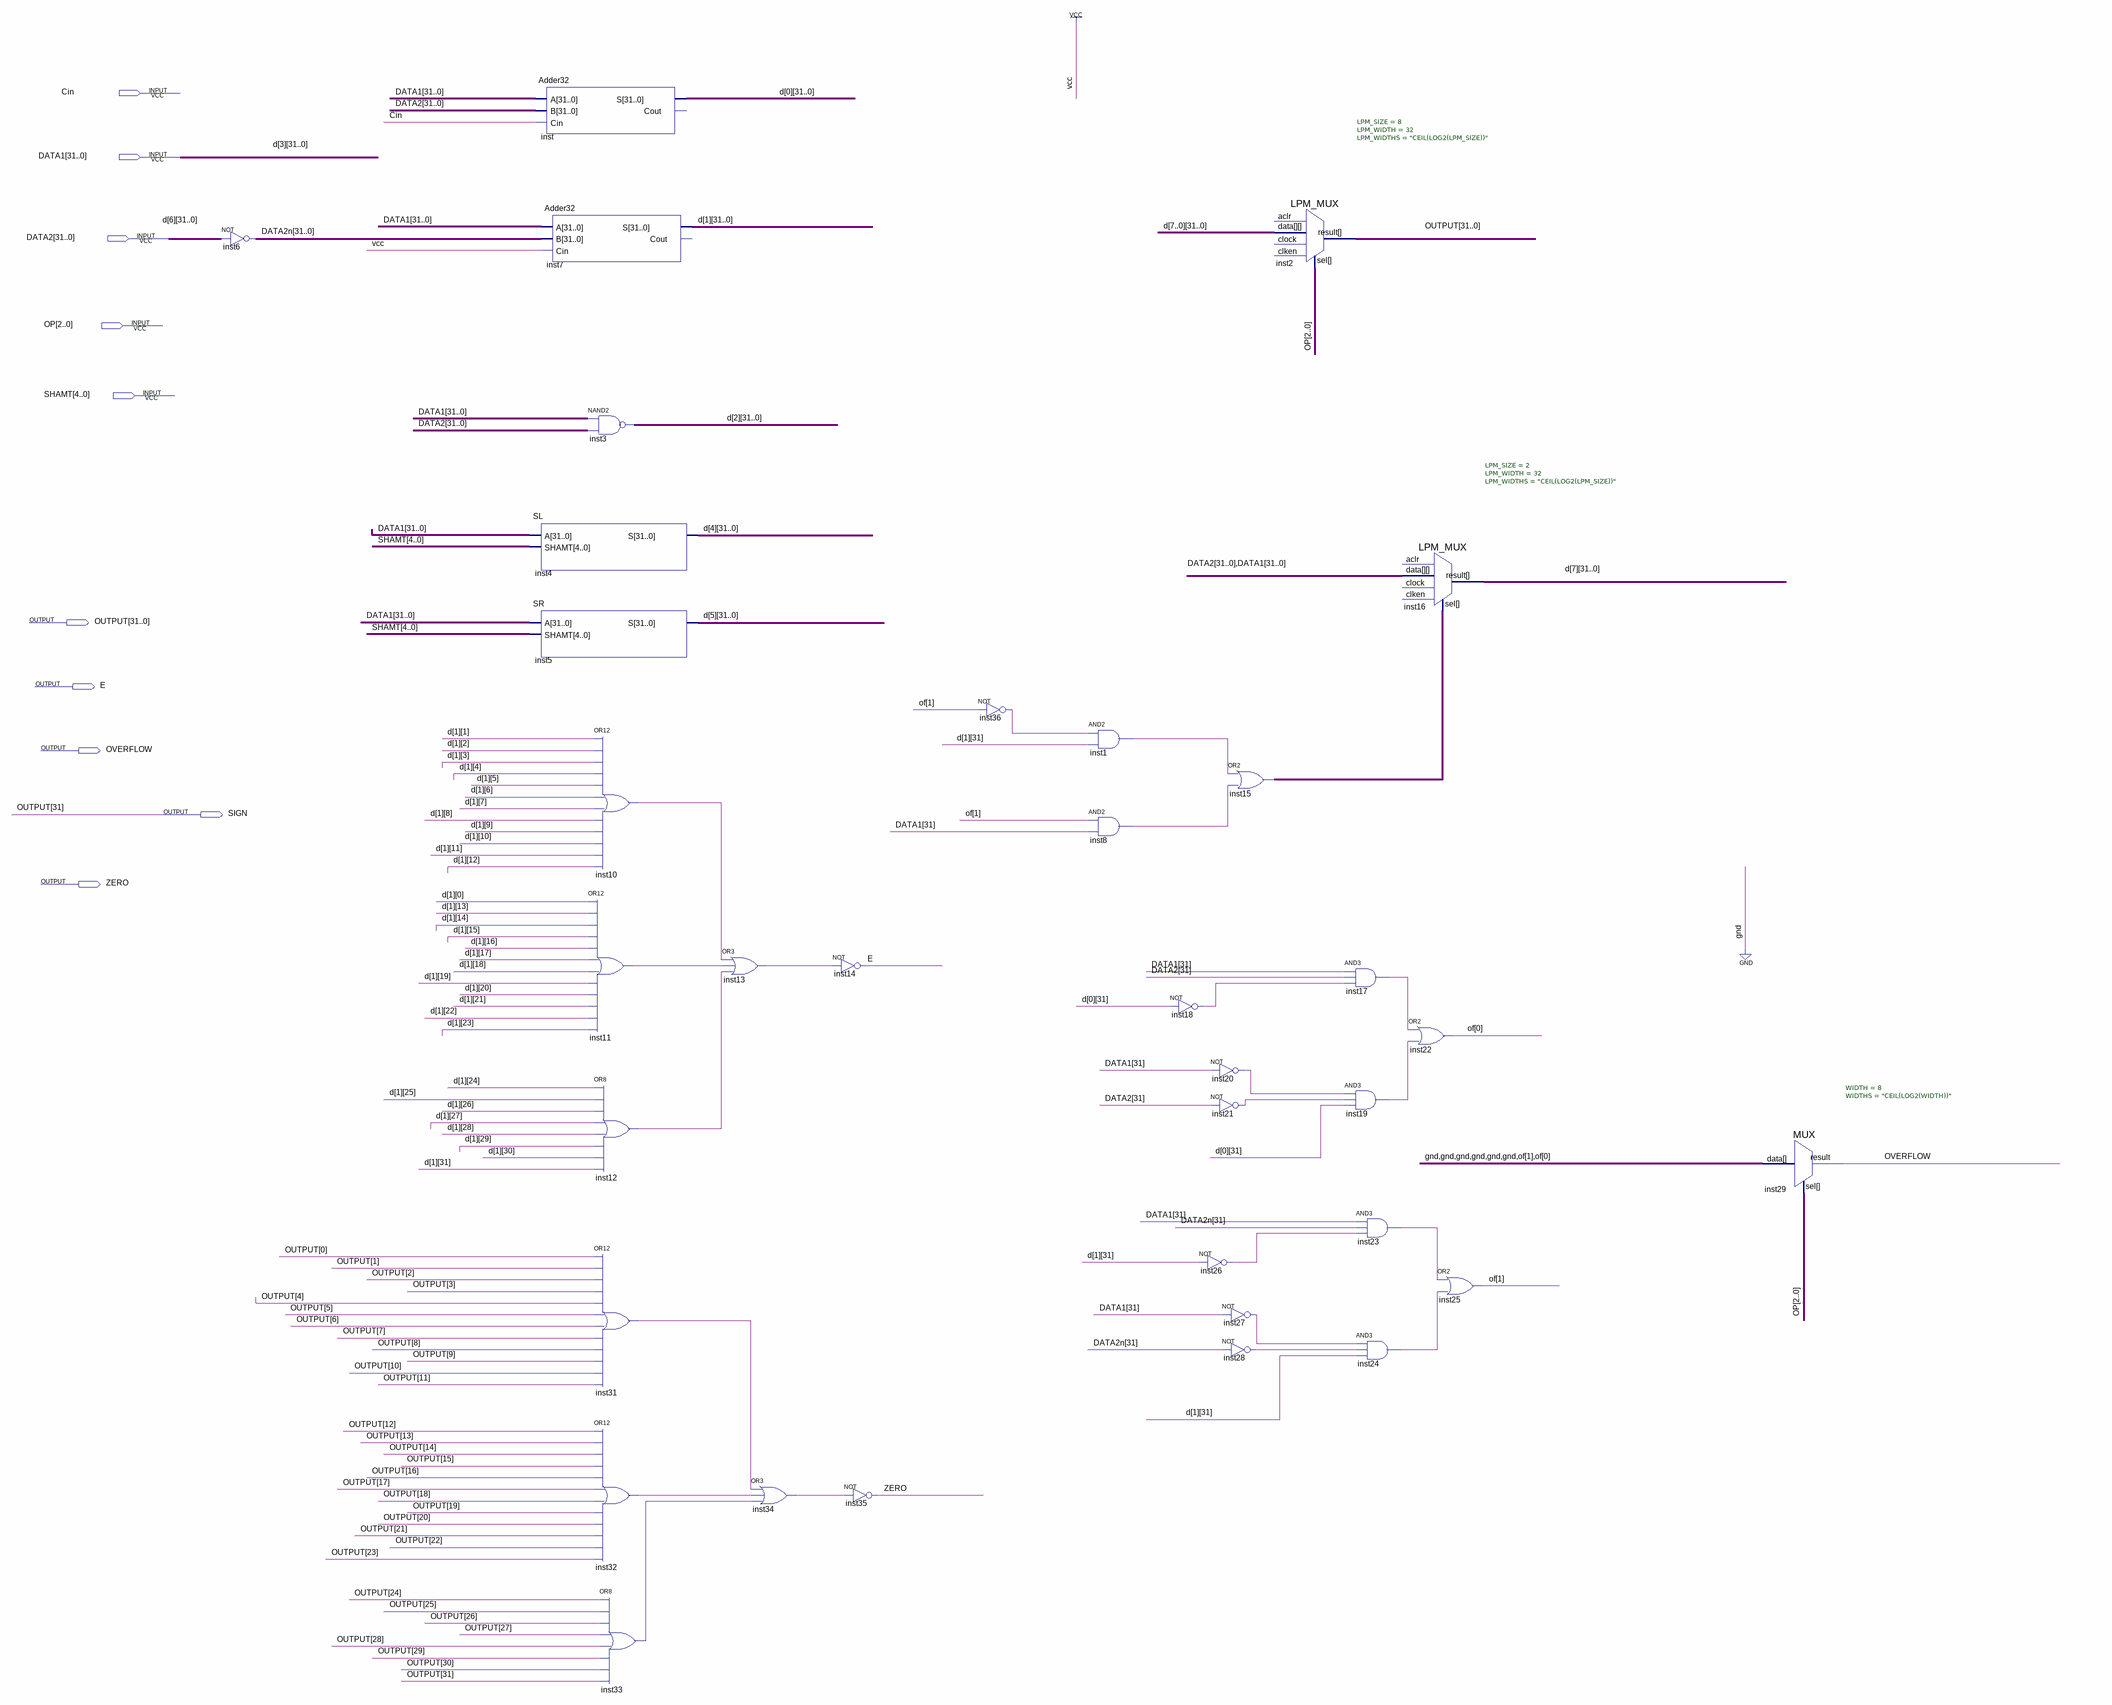
[diagram p0: schematic sheet]
// Quartus schematic ALU.bdf as structural Verilog: 35 symbols, 10 pins
module ALU (
  input  Cin,
  input  [31:0] DATA1,
  input  [31:0] DATA2,
  input  [2:0] OP,
  input  [4:0] SHAMT,
  output [31:0] OUTPUT,
  output E,
  output OVERFLOW,
  output SIGN,
  output ZERO
);

  wire inst1_out, inst8_out, inst10_out, inst11_out, inst12_out, inst13_out, inst15_out, inst17_out,
       inst18_out, inst19_out, inst20_out, inst21_out, inst23_out, inst24_out, inst26_out, inst27_out,
       inst28_out, inst31_out, inst32_out, inst33_out, inst34_out, inst36_out;
  wire [1:0] of;
  wire [31:0] d_0, d_1, d_2, d_4, d_5, d_7, DATA2n;

  assign DATA2n = ~DATA2;  // NOT inst6, 32 bits wide
  Adder32 inst (.A(DATA1), .B(DATA2), .Cin(Cin), .S(d_0));  // open: Cout
  Adder32 inst7 (.A(DATA1), .B(DATA2n), .Cin(1'b1), .S(d_1));  // open: Cout
  SL inst4 (.A(DATA1), .SHAMT(SHAMT), .S(d_4));
  SR inst5 (.A(DATA1), .SHAMT(SHAMT), .S(d_5));
  assign d_2 = ~(DATA1 & DATA2);  // NAND2 inst3, 32 bits wide
  or inst10 (inst10_out, d_1[1], d_1[2], d_1[3], d_1[4], d_1[5], d_1[6], d_1[7], d_1[8], d_1[9], d_1[10], d_1[11], d_1[12]);
  or inst11 (inst11_out, d_1[0], d_1[13], d_1[14], d_1[15], d_1[16], d_1[17], d_1[18], d_1[19], d_1[20], d_1[21], d_1[22], d_1[23]);
  or inst12 (inst12_out, d_1[24], d_1[25], d_1[26], d_1[27], d_1[28], d_1[29], d_1[30], d_1[31]);
  or inst31 (inst31_out, OUTPUT[0], OUTPUT[1], OUTPUT[2], OUTPUT[3], OUTPUT[4], OUTPUT[5], OUTPUT[6], OUTPUT[7], OUTPUT[8], OUTPUT[9], OUTPUT[10], OUTPUT[11]);
  or inst32 (inst32_out, OUTPUT[12], OUTPUT[13], OUTPUT[14], OUTPUT[15], OUTPUT[16], OUTPUT[17], OUTPUT[18], OUTPUT[19], OUTPUT[20], OUTPUT[21], OUTPUT[22], OUTPUT[23]);
  or inst33 (inst33_out, OUTPUT[24], OUTPUT[25], OUTPUT[26], OUTPUT[27], OUTPUT[28], OUTPUT[29], OUTPUT[30], OUTPUT[31]);
  or inst13 (inst13_out, inst10_out, inst11_out, inst12_out);
  or inst34 (inst34_out, inst31_out, inst32_out, inst33_out);
  not inst14 (E, inst13_out);
  not inst35 (ZERO, inst34_out);
  not inst36 (inst36_out, of[1]);
  and inst1 (inst1_out, inst36_out, d_1[31]);
  and inst8 (inst8_out, of[1], DATA1[31]);
  not inst18 (inst18_out, d_0[31]);
  not inst26 (inst26_out, d_1[31]);
  or inst15 (inst15_out, inst1_out, inst8_out);
  not inst20 (inst20_out, DATA1[31]);
  not inst21 (inst21_out, DATA2[31]);
  not inst27 (inst27_out, DATA1[31]);
  not inst28 (inst28_out, DATA2n[31]);
  LPM_MUX #(.LPM_SIZE(8), .LPM_WIDTH(32), .LPM_WIDTHS("CEIL(LOG2(LPM_SIZE))")) inst2 (
    .data({d_7, DATA2, d_5, d_4, DATA1, d_2, d_1, d_0}), .sel(OP), .result(OUTPUT));  // open: clock, aclr, clken
  and inst17 (inst17_out, DATA1[31], DATA2[31], inst18_out);
  and inst19 (inst19_out, inst20_out, inst21_out, d_0[31]);
  and inst23 (inst23_out, DATA1[31], DATA2n[31], inst26_out);
  and inst24 (inst24_out, inst27_out, inst28_out, d_1[31]);
  LPM_MUX #(.LPM_SIZE(2), .LPM_WIDTH(32), .LPM_WIDTHS("CEIL(LOG2(LPM_SIZE))")) inst16 (
    .data({DATA2, DATA1}), .sel(inst15_out), .result(d_7));  // open: clock, aclr, clken
  or inst22 (of[0], inst17_out, inst19_out);
  or inst25 (of[1], inst23_out, inst24_out);
  MUX #(.WIDTH(8), .WIDTHS("CEIL(LOG2(WIDTH))")) inst29 (.data({{6{1'b0}}, of}), .sel(OP), .result(OVERFLOW));

  assign SIGN = OUTPUT[31];

  // Other names for the same wires on the sheet: d_3[31:0] = DATA1; d_6[31:0] = DATA2
endmodule
